# Altium schematic sheet Top.SchDoc: 7-Segment LED Matrix Display
size A4; Address1: Smoka Wawelskiego 1; Address2: 30-535 Kraków, Poland; DocumentNumber: 1; Revision: v01; SheetNumber: 1; SheetTotal: 9; Author: Miroslaw Folejewski; CompanyName: Mirko Electronics; DrawnBy: Miroslaw Folejewski; Engineer: Miroslaw Folejewski; PageSetup: Record=PageOptions|CenterHorizontal=True|CenterVertical=True|PrintScale=1.00|XCorrection=1.00|YCorrection=1.00|PrintKind=0|BorderSize=5000000|LeftOffset=0|BottomOffset=0|Orientation=2|PaperLength=1000|PaperWidth=1000|Scale=100|PaperSource=7|PrintQuality=-4|MediaType=1|DitherType=10|PaperKind=A4|PrintScaleMode=1; PageSize: A4; Designators: -; ProjectName: 7-Segment LED Matrix Display
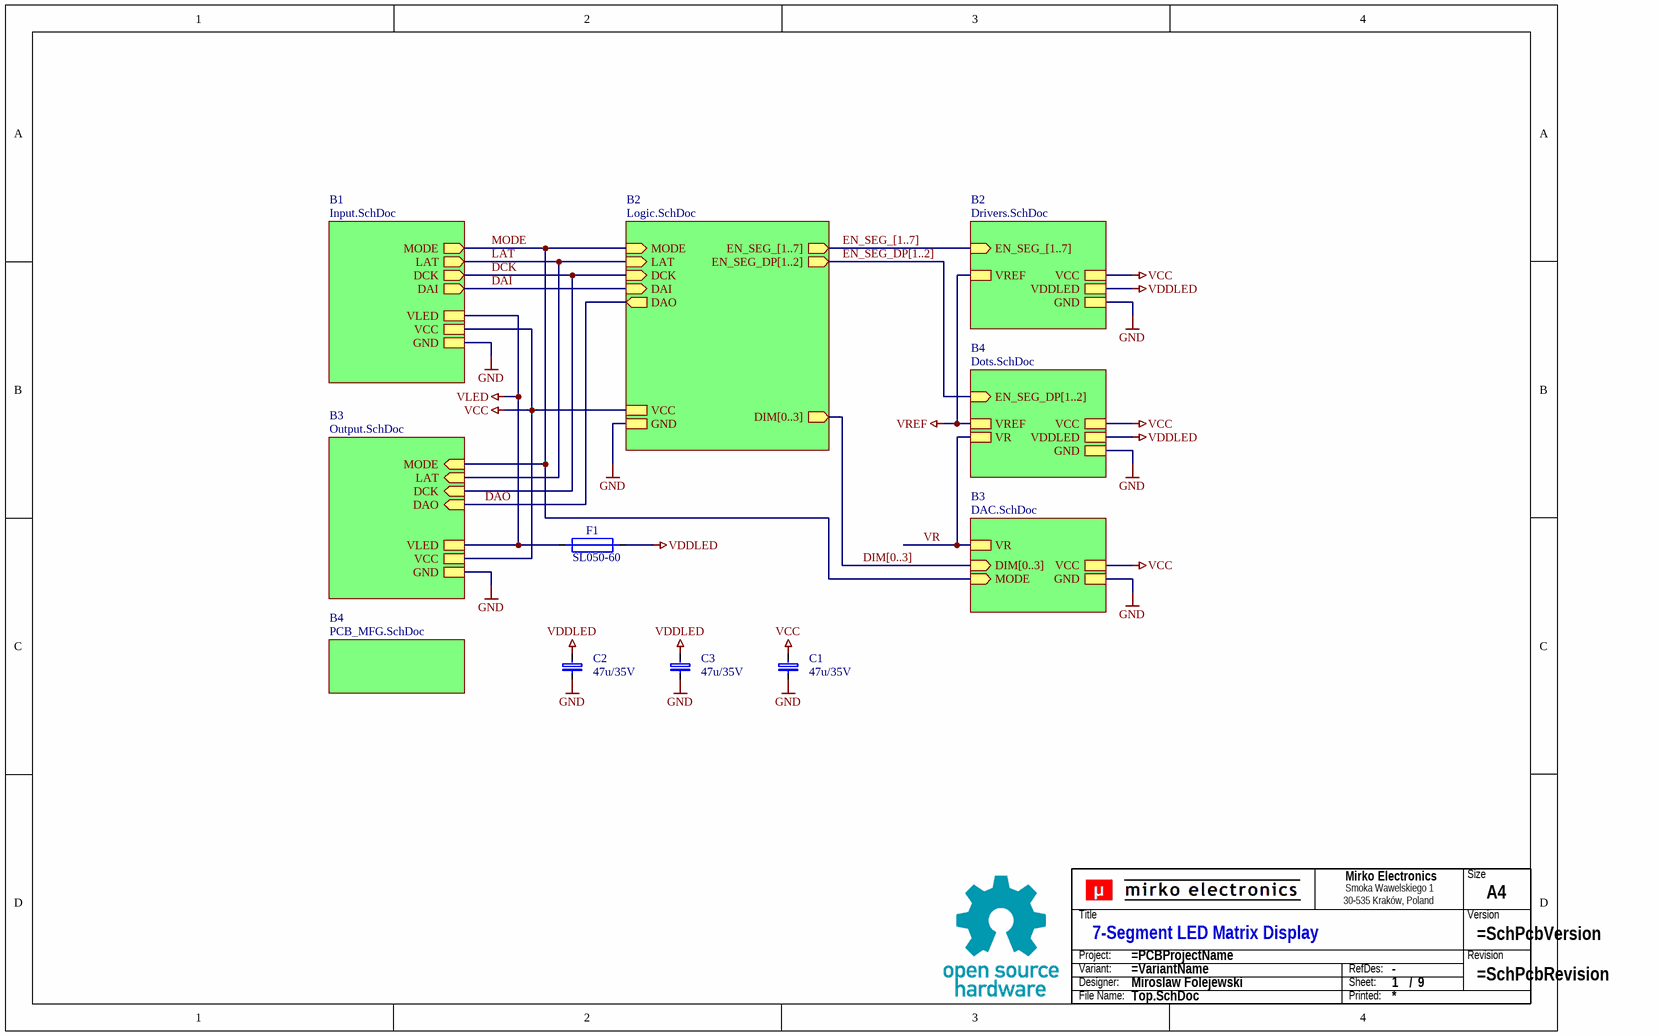
[diagram p0: Top.SchDoc]

## Parts
?  (no value)  (graphical)
C1  47u/35V  [CAP_V_6.3X11]
C2  47u/35V  [CAP_V_6.3X11]
C3  47u/35V  [CAP_V_6.3X11]
F1  SL050-60  [2920]
TB?  Title block  (value not drawn)  (graphical)

## Sub-sheets
B1 = Input.SchDoc: MODE (out), LAT (out), DCK (out), DAI (out), VCC, VLED, GND
B2 = Logic.SchDoc: MODE (in), LAT (in), DCK (in), DAI (in), VCC, GND, DAO (out), EN_SEG_[1..7] (out), EN_SEG_DP[1..2] (out), DIM[0..3] (out)
B2 = Drivers.SchDoc: EN_SEG_[1..7] (in), VCC, VDDLED, GND, VREF
B3 = Output.SchDoc: MODE (in), LAT (in), DCK (in), VCC, VLED, GND, DAO (in)
B3 = DAC.SchDoc: DIM[0..3] (in), VCC, MODE (in), GND, VR
B4 = PCB_MFG.SchDoc: no entries
B4 = Dots.SchDoc: EN_SEG_DP[1..2] (in), VCC, VDDLED, GND, VREF, VR

## Nets
GND: C1.1 C2.1 C3.1 ; sheet B1/GND, sheet B2/GND, sheet B3/GND, sheet B2/GND, sheet B3/GND, sheet B4/GND
VCC: C1.2 ; sheet B1/VCC, sheet B2/VCC, sheet B3/VCC, sheet B2/VCC, sheet B3/VCC, sheet B4/VCC
VDDLED: C2.2 C3.2 F1.1 ; sheet B2/VDDLED, sheet B4/VDDLED
VLED: F1.2 ; sheet B1/VLED, sheet B3/VLED
VREF: sheet B2/VREF, sheet B4/VREF
DAI: sheet B1/DAI, sheet B2/DAI
DAO: sheet B2/DAO, sheet B3/DAO
DCK: sheet B1/DCK, sheet B2/DCK, sheet B3/DCK
LAT: sheet B1/LAT, sheet B2/LAT, sheet B3/LAT
MODE: sheet B1/MODE, sheet B2/MODE, sheet B3/MODE, sheet B3/MODE
VR: sheet B3/VR, sheet B4/VR

## Buses and harness runs
bus DIM[0..3] = sheet B2/DIM[0..3] = sheet B3/DIM[0..3]
bus EN_SEG_[1..7] = sheet B2/EN_SEG_[1..7]
bus EN_SEG_DP[1..2] = sheet B2/EN_SEG_DP[1..2] = sheet B4/EN_SEG_DP[1..2]

## Notes on the sheet
- Title
- Size
- Revision
- Checked By:
- Project:
- Variant:
- Engineer:
- Date:
- Sheet:
- /
- Designators
- Approved By:
- File:
- (in symbol SCH_TITLE_BLOCK_V1) Size; Title; Version; Project:; Revision; Variant:; RefDes:; Designer:; Sheet:; /; File Name:; Printed:

## Library data of the parts
? = Title Block NeoStrain
C1-C3 = CAP_EL_SMD: Kondensator elektrolityczny 2.5x6.3x11
F1 = FUSE
TB? = SCH_TITLE_BLOCK_V1: Component Type: Title block; Manufacturer: -; Mounting Type: Non component; MPN: -; Operating Temperature: -; Package: -; Specification: Title block; Value: Title block; Replacement: -; System: ?